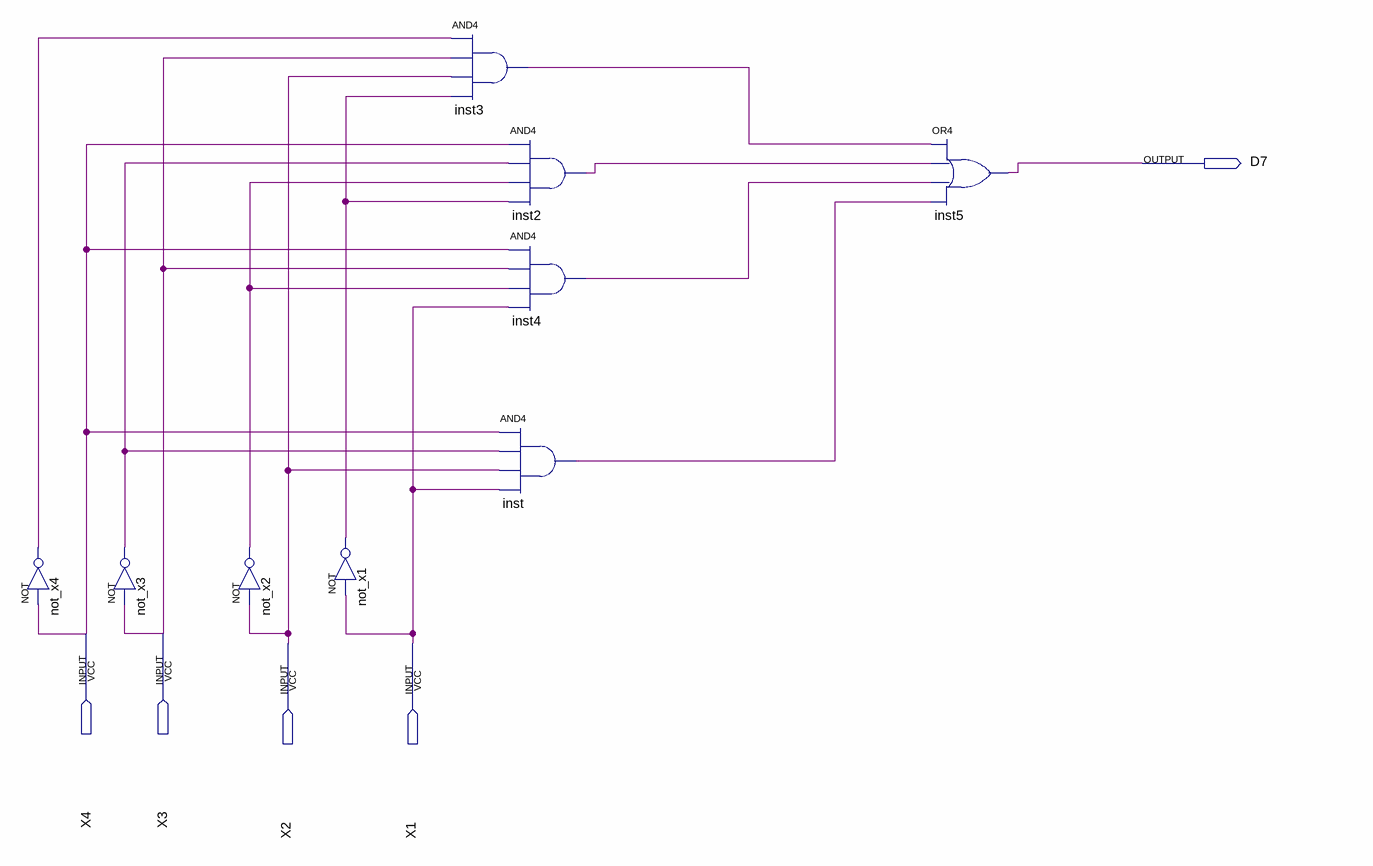
[diagram p0: schematic sheet]
// Quartus schematic conv_D7.bdf as structural Verilog: 9 symbols, 5 pins
module conv_D7 (
  input  X4,
  input  X3,
  input  X2,
  input  X1,
  output D7
);

  wire inst2_out, inst3_out, inst4_out, inst_out, not_x1_out, not_x2_out, not_x3_out, not_x4_out;

  not not_x4 (not_x4_out, X4);
  not not_x3 (not_x3_out, X3);
  not not_x2 (not_x2_out, X2);
  not not_x1 (not_x1_out, X1);
  and inst3 (inst3_out, not_x4_out, X3, X2, not_x1_out);
  and inst2 (inst2_out, X4, not_x3_out, not_x2_out, not_x1_out);
  and inst4 (inst4_out, X4, X3, not_x2_out, X1);
  and inst (inst_out, X4, not_x3_out, X2, X1);
  or inst5 (D7, inst3_out, inst2_out, inst4_out, inst_out);
endmodule
